# EAGLE design alpha-issue2-v23 (EAGLE 9.0.1)
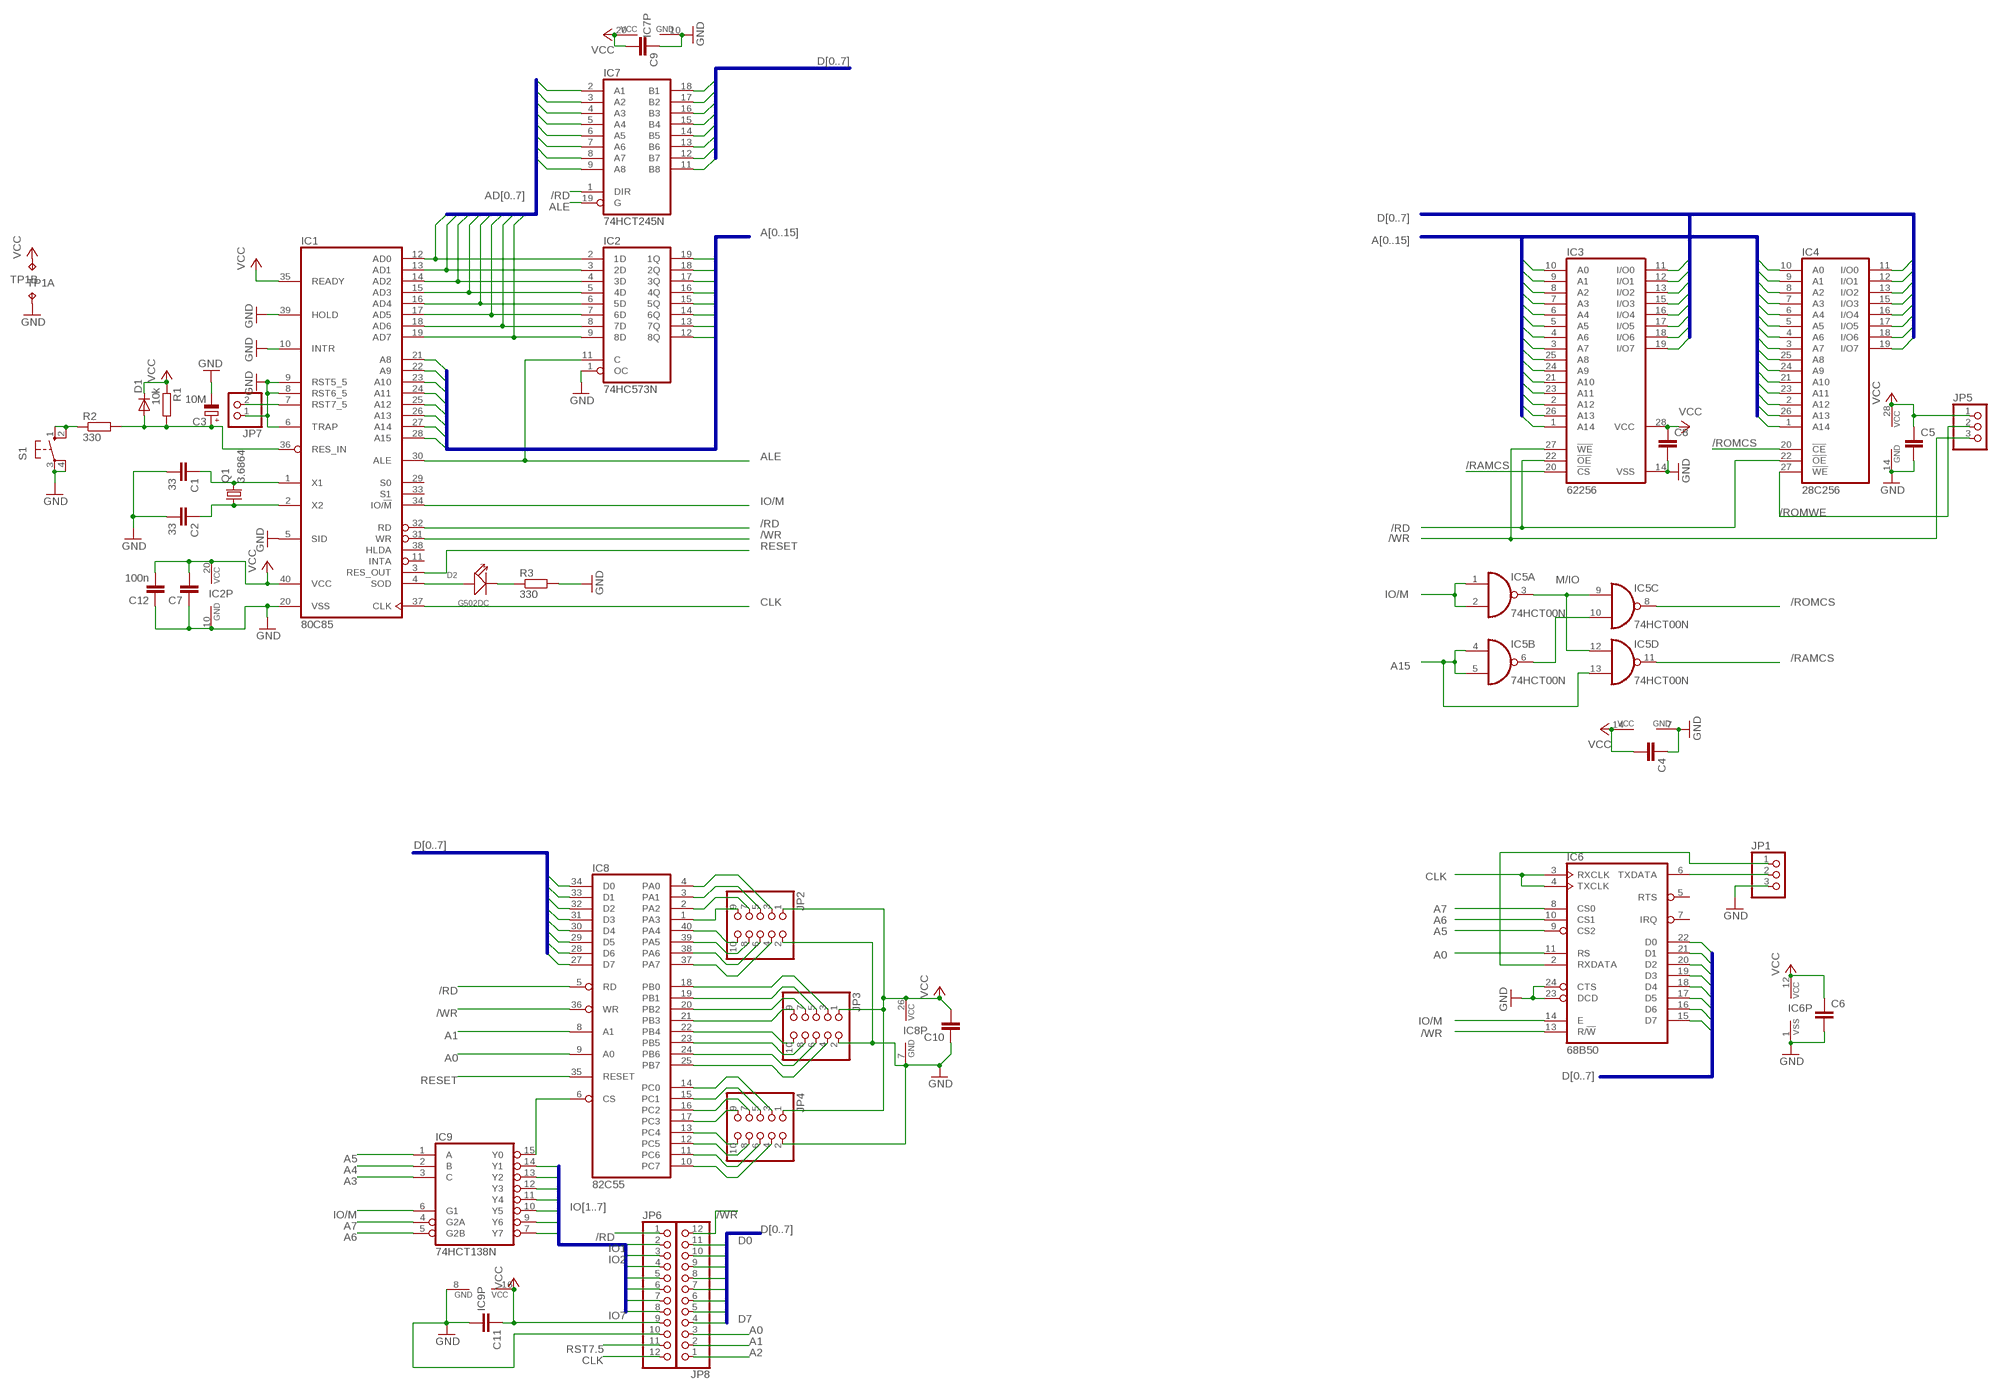
[diagram p0: schematic, sheet 1]

## Parts
C1  33  C-EU025-040X050  [C025-040X050]
C2  33  C-EU025-040X050  [C025-040X050]
C3  10M  CPOL-EUE5-8.5  [E5-8,5]
C4  C-EU050-025X075  [C050-025X075]
C5  C-EU050-025X075  [C050-025X075]
C6  C-EU050-025X075  [C050-025X075]
C7  C-EU050-025X075  [C050-025X075]
C8  C-EU050-025X075  [C050-025X075]
C9  C-EU050-025X075  [C050-025X075]
C10  C-EU050-025X075  [C050-025X075]
C11  C-EU050-025X075  [C050-025X075]
C12  100n  C-EU050-025X075  [C050-025X075]
D1  1N4004  [DO41-10]
D2  G502DC  DIP-LED-GREEN-GREEN(2P-D5MM)  [LED2-2.54-D5.0MM]
IC1  80C85  8085  [DIL40]
IC2  74HC573N  [DIL20]
IC3  62256  62256P  [DIL28-6]
IC4  28C256  [DIL28]
IC5  74HCT00N  [DIL14]
IC6  68B50  6850  [DIL24]
IC7  74HCT245N  [DIL20]
IC8  82C55  8255A  [DIL40]
IC9  74HCT138N  [DIL16]
JP1  PINHD-1X3  [1X03]
JP2  PINHD-2X5  [2X05]
JP3  PINHD-2X5  [2X05]
JP4  PINHD-2X5  [2X05]
JP5  PINHD-1X3  [1X03]
JP6  PINHD-1X12  [1X12]
JP7  PINHD-1X2  [1X02]
JP8  PINHD-1X12  [1X12]
Q1  3.6864  CRYSTALHC49S  [HC49/S]
R1  10k  R-EU_0207/10  [0207/10]
R2  330  R-EU_0207/10  [0207/10]
R3  330  R-EU_0207/7  [0207/7]
S1  40-XX  [B3F-40XX]
TP1  TP2P2-38-17  [P2-38-17]

## Nets
/RAMCS: IC3.20(!CS) IC5.11(D:O)
/RD: IC1.32(RD) IC3.22(!OE) IC4.22(!OE) IC7.1(DIR) IC8.5(RD) JP6.1
/ROMCS: IC4.20(!CE) IC5.8(C:O)
/ROMWE [gnd]: IC4.27(!WE) JP5.2
/WR: IC1.31(WR) IC3.27(!WE) IC6.13(R/!W) IC8.36(WR) JP5.3 JP8.12
A0: IC2.19(1Q) IC3.10(A0) IC4.10(A0) IC6.11(RS) IC8.9(A0) JP8.3
A1: IC2.18(2Q) IC3.9(A1) IC4.9(A1) IC8.8(A1) JP8.2
A2: IC2.17(3Q) IC3.8(A2) IC4.8(A2) JP8.1
A3: IC2.16(4Q) IC3.7(A3) IC4.7(A3) IC9.3(C)
A4: IC2.15(5Q) IC3.6(A4) IC4.6(A4) IC9.2(B)
A5: IC2.14(6Q) IC3.5(A5) IC4.5(A5) IC6.9(CS2) IC9.1(A)
A6: IC2.13(7Q) IC3.4(A6) IC4.4(A6) IC6.10(CS1) IC9.5(G2B)
A7: IC2.12(8Q) IC3.3(A7) IC4.3(A7) IC6.8(CS0) IC9.4(G2A)
A8: IC1.21(A8) IC3.25(A8) IC4.25(A8)
A9: IC1.22(A9) IC3.24(A9) IC4.24(A9)
A10: IC1.23(A10) IC3.21(A10) IC4.21(A10)
A11: IC1.24(A11) IC3.23(A11) IC4.23(A11)
A12: IC1.25(A12) IC3.2(A12) IC4.2(A12)
A13: IC1.26(A13) IC3.26(A13) IC4.26(A13)
A14: IC1.27(A14) IC3.1(A14) IC4.1(A14)
A15: IC1.28(A15) IC5.4(B:I0) IC5.5(B:I1) IC5.13(D:I1)
ALE: IC1.30(ALE) IC2.11(C) IC7.19(G)
CLK: IC1.37(CLK) IC6.3(RXCLK) IC6.4(TXCLK) JP6.12
D0: IC3.11(I/O0) IC4.11(I/O0) IC6.22(D0) IC7.18(B1) IC8.34(D0) JP8.11
D1: IC3.12(I/O1) IC4.12(I/O1) IC6.21(D1) IC7.17(B2) IC8.33(D1) JP8.10
D2: IC3.13(I/O2) IC4.13(I/O2) IC6.20(D2) IC7.16(B3) IC8.32(D2) JP8.9
D3: IC3.15(I/O3) IC4.15(I/O3) IC6.19(D3) IC7.15(B4) IC8.31(D3) JP8.8
D4: IC3.16(I/O4) IC4.16(I/O4) IC6.18(D4) IC7.14(B5) IC8.30(D4) JP8.7
D5: IC3.17(I/O5) IC4.17(I/O5) IC6.17(D5) IC7.13(B6) IC8.29(D5) JP8.6
D6: IC3.18(I/O6) IC4.18(I/O6) IC6.16(D6) IC7.12(B7) IC8.28(D6) JP8.5
D7: IC3.19(I/O7) IC4.19(I/O7) IC6.15(D7) IC7.11(B8) IC8.27(D7) JP8.4
DX0: IC1.12(AD0) IC2.2(1D) IC7.2(A1)
DX1: IC1.13(AD1) IC2.3(2D) IC7.3(A2)
DX2: IC1.14(AD2) IC2.4(3D) IC7.4(A3)
DX3: IC1.15(AD3) IC2.5(4D) IC7.5(A4)
DX4: IC1.16(AD4) IC2.6(5D) IC7.6(A5)
DX5: IC1.17(AD5) IC2.7(6D) IC7.7(A6)
DX6: IC1.18(AD6) IC2.8(7D) IC7.8(A7)
DX7: IC1.19(AD7) IC2.9(8D) IC7.9(A8)
GND [gnd]: C1.2 C2.2 C3.- C4.1 C5.2 C6.2 C7.1 C8.2 C9.1 C10.1 C11.2 C12.1 IC1.5(SID) IC1.6(TRAP) IC1.8(RST6_5) IC1.9(RST5_5) IC1.10(INTR) IC1.20(VSS) IC1.39(HOLD) IC2.1(OC) IC2.10(GND) IC3.14(VSS) IC4.14(GND) IC5.7(P:GND) IC6.1(VSS) IC6.23(DCD) IC6.24(CTS) IC7.10(GND) IC8.7(GND) IC9.8(GND) JP1.3 JP2.2 JP3.2 JP4.2 JP6.10 JP7.1 R3.2 S1.3(P) S1.4(P1) TP1.TP-1
IO1: IC9.14(Y1) JP6.2
IO2: IC9.13(Y2) JP6.3
IO3: IC9.12(Y3) JP6.4
IO4: IC9.11(Y4) JP6.5
IO5: IC9.10(Y5) JP6.6
IO6: IC9.9(Y6) JP6.7
IO7: IC9.7(Y7) JP6.8
IO/M: IC1.34(IO/!M) IC5.1(A:I0) IC5.2(A:I1) IC6.14(E) IC9.6(G1)
M/IO: IC5.3(A:O) IC5.9(C:I0) IC5.12(D:I0)
N$1: C1.1 IC1.1(X1) Q1.2
N$2: C2.1 IC1.2(X2) Q1.1
N$3: D2.+ IC1.4(SOD)
N$4: D2.- R3.1
N$5: IC6.6(TXDATA) JP1.2
N$6: C3.+ D1.A IC1.36(RES_IN) R1.2 R2.2
N$7: R2.1 S1.1(S) S1.2(S1)
N$8: IC5.6(B:O) IC5.10(C:I1)
N$9: IC8.1(PA3) JP2.9
N$10: IC6.2(RXDATA) JP1.1
N$11: IC8.2(PA2) JP2.7
N$12: IC8.3(PA1) JP2.5
N$13: IC8.4(PA0) JP2.3
N$14: IC8.40(PA4) JP2.10
N$15: IC8.39(PA5) JP2.8
N$16: IC8.38(PA6) JP2.6
N$17: IC8.37(PA7) JP2.4
N$18: IC8.21(PB3) JP3.9
N$19: IC8.20(PB2) JP3.7
N$20: IC8.19(PB1) JP3.5
N$21: IC8.18(PB0) JP3.3
N$22: IC8.22(PB4) JP3.10
N$23: IC8.23(PB5) JP3.8
N$24: IC8.24(PB6) JP3.6
N$25: IC8.25(PB7) JP3.4
N$26: IC8.17(PC3) JP4.9
N$27: IC8.13(PC4) JP4.10
N$28: IC8.16(PC2) JP4.7
N$29: IC8.15(PC1) JP4.5
N$30: IC8.14(PC0) JP4.3
N$31: IC8.12(PC5) JP4.8
N$32: IC8.11(PC6) JP4.6
N$33: IC8.10(PC7) JP4.4
N$36: IC8.6(CS) IC9.15(Y0)
RESET: IC1.3(RES_OUT) IC8.35(RESET)
RST7.5: IC1.7(RST7_5) JP6.11 JP7.2
VCC [gnd]: C4.2 C5.1 C6.1 C7.2 C8.1 C9.2 C10.2 C11.1 C12.2 D1.C IC1.35(READY) IC1.40(VCC) IC2.20(VCC) IC3.28(VCC) IC4.28(VCC) IC5.14(P:VCC) IC6.12(VCC) IC7.20(VCC) IC8.26(VCC) IC9.16(VCC) JP2.1 JP3.1 JP4.1 JP5.1 JP6.9 R1.1 TP1.TP-2
Unconnected: IC1.11(INTA) IC1.29(S0) IC1.33(S1) IC1.38(HLDA) IC6.5(RTS) IC6.7(IRQ)

## Buses
A[0..15]
D[0..7]
AD[0..7]
IO[1..7]

## Library data of the parts
C1 C2 C4-C12 = rcl:C-EU: CAPACITOR, European symbol
C3 = rcl:CPOL-EU: POLARIZED CAPACITOR, European symbol
D1 = diode:1N4004: DIODE general purpose rectifier, 1 A
D2 = Seeed-LED:DIP-LED-GREEN-GREEN(2P-D5MM): 304090038; MPN: G502DC
IC1 = micro-intel:8085: MICROCOMPUTER/PERIPHERAL DEVICE; OC_FARNELL: unknown; OC_NEWARK: unknown
IC2 = 74xx-eu:74*573: 8-bit D latch BUS DRIVER
IC3 = memory-hitachi:62256P: MEMORY; OC_FARNELL: unknown; OC_NEWARK: unknown
IC4 = memory:28C256: MEMORY
IC5 = 74xx-eu:74*00: Quad 2-input NAND gate
IC6 = micro-motorola:6850: MICROCONTROLLER/MEMORY DEVICE; MF: NTE ELECTRONICS; MPN: NTE6850; OC_FARNELL: 4899775; OC_NEWARK: 31C2457
IC7 = 74xx-eu:74*245: Octal BUS TRANSCEIVER, 3-state
IC8 = micro-intel:8255A: MICROCOMPUTER/PERIPHERAL DEVICE; OC_FARNELL: unknown; OC_NEWARK: unknown
IC9 = 74xx-eu:74*138: 3-line to 8-line DECODER/DEMULTIPLEXER
JP1 JP5 = pinhead:PINHD-1X3: PIN HEADER
JP2-JP4 = pinhead:PINHD-2X5: PIN HEADER
JP6 JP8 = pinhead:PINHD-1X12: PIN HEADER
JP7 = pinhead:PINHD-1X2: PIN HEADER
Q1 = crystal:CRYSTAL: CRYSTAL; OC_FARNELL: 1667008; OC_NEWARK: unknown
R1-R3 = rcl:R-EU_: RESISTOR, European symbol
S1 = adafruit:40-XX: OMRON SWITCH; MF: OMRON COMPONENTS USA; MPN: B3F-4000; OC_FARNELL: 176434; OC_NEWARK: 36K3105
TP1 = testpad:TP2: Test pad

## Net classes
0 default: width 0.305 mm
1 gnd: width 0.61 mm

## Board
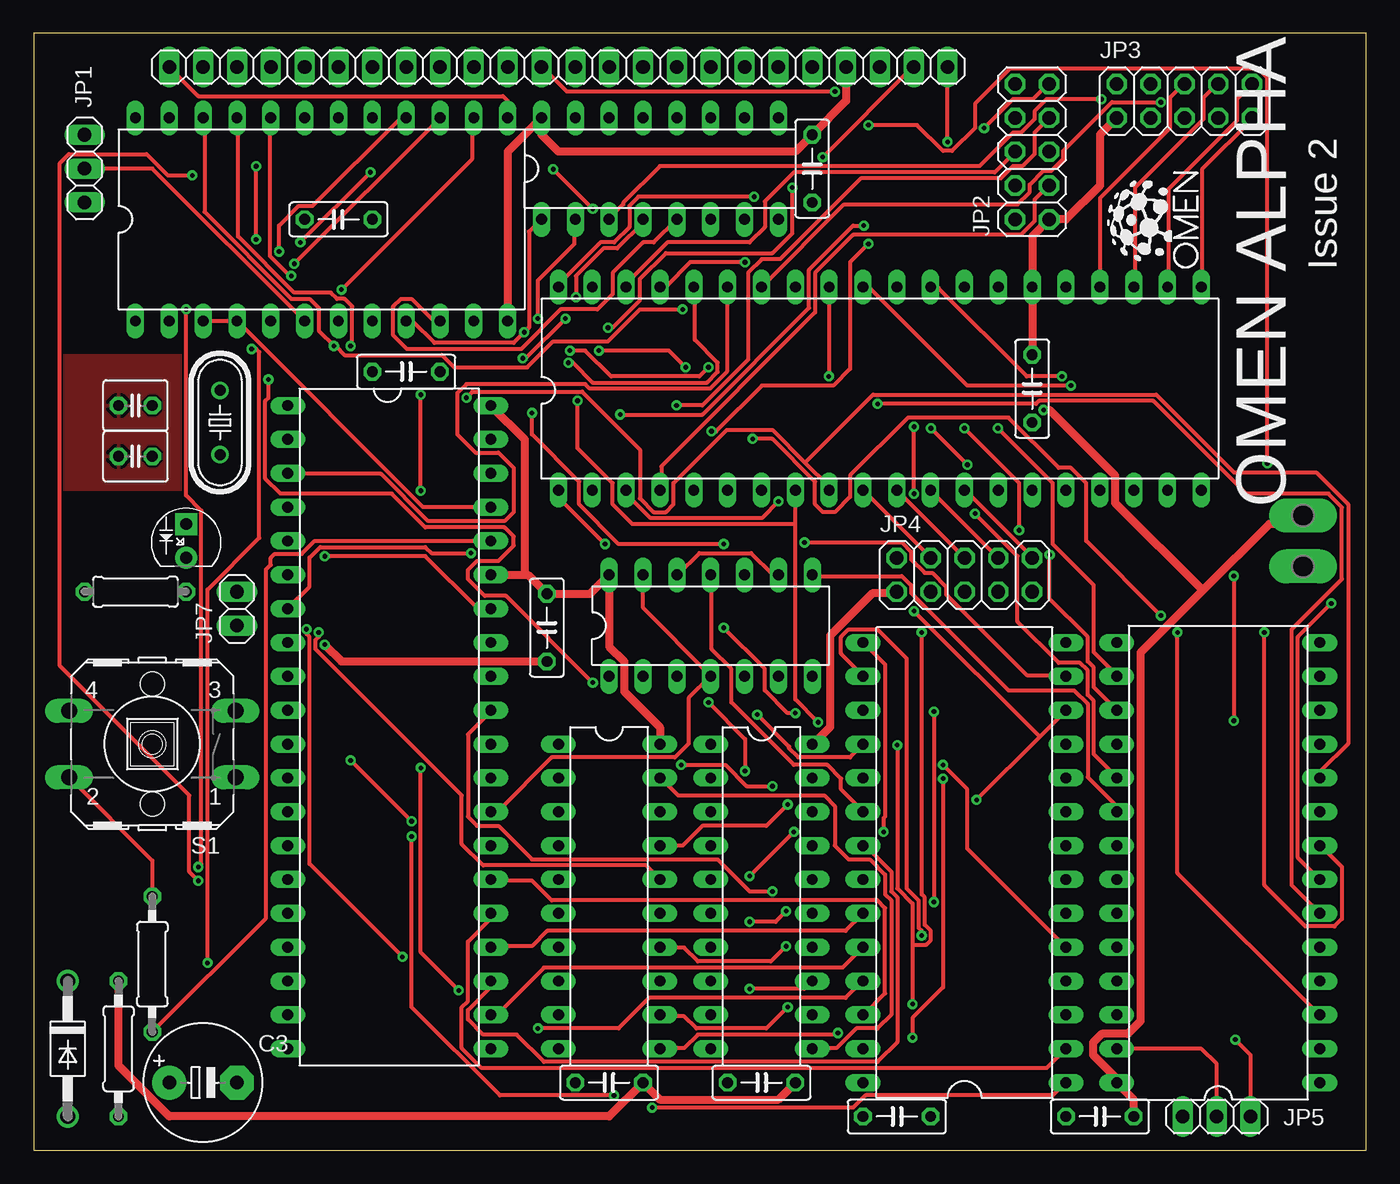
[diagram p1: board, top side]
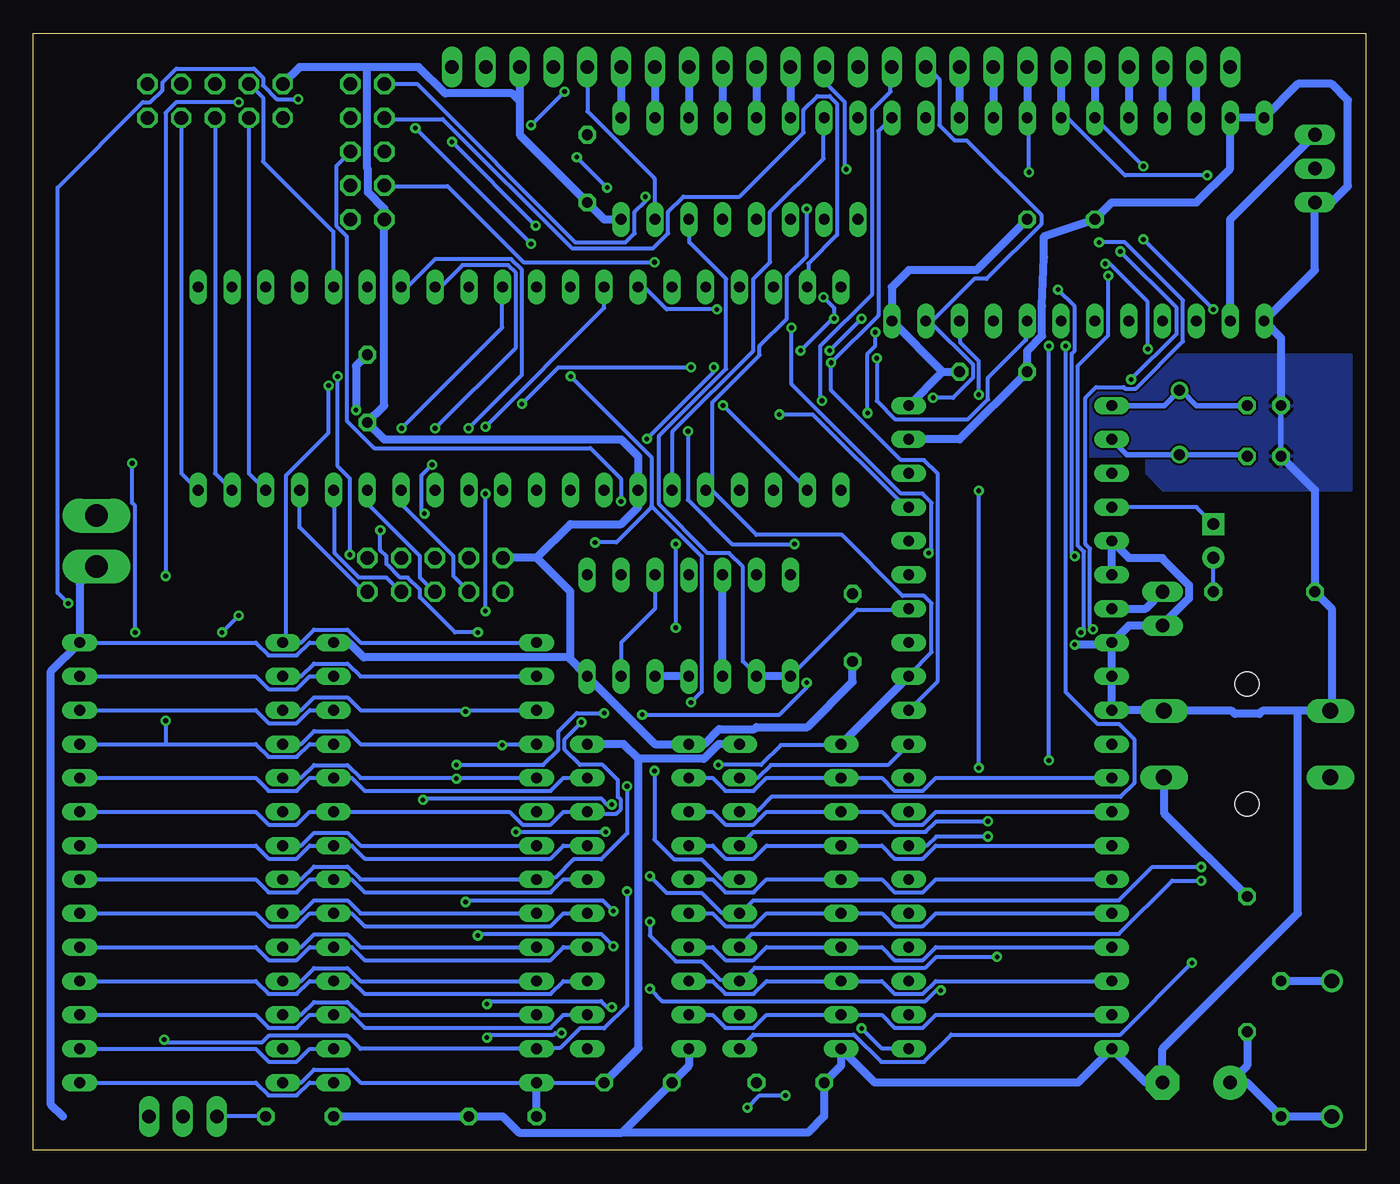
[diagram p2: board, bottom side, seen from below]

Size 100 x 83.81 mm. Coordinates in mm from the lower left corner, seen from the top.
Outline: 0,0 100,0 100,83.81 0,83.81 0,0
Copper layers (1*16): Top 0.035mm / dielectric 1.5mm / Bottom 0.035mm
Design rules "default": minimum track width 6mil, minimum drill 0.35mm, track to track 6mil, track to pad 6mil, pad to pad 6mil, via to via 6mil, smd to smd 6mil, copper to edge 40mil, drill to drill 6mil, minimum pad ring 10mil, minimum via ring 8mil, stop-mask expansion 4mil, vias tented up to drill 0mil, thermal gap 10mil

### Footprints (pad centres in the part's own frame; a part is rotated, then mirrored left to right if it is on the bottom)
C025-040X050 = drill 0.813 octagon: 1 -1.27,0; 2 1.27,0
E5-8,5 = drill 1.016 pad 2.54: + -2.54,0 | drill 1.016 pad 2.54 octagon: - 2.54,0
C050-025X075 = drill 0.813 octagon: 1 -2.54,0; 2 2.54,0
DO41-10 = drill 1.118: A 5.08,0; C -5.08,0
LED2-2.54-D5.0MM = drill 0.889 pad 1.651 square: + -1.27,0 | drill 0.889 pad 1.651: - 1.27,0
DIL40 = drill 0.813 long: 1 -24.13,-7.62; 2 -21.59,-7.62; 3 -19.05,-7.62; 4 -16.51,-7.62; 5 -13.97,-7.62; 6 -11.43,-7.62; 7 -8.89,-7.62; 8 -6.35,-7.62; 9 -3.81,-7.62; 10 -1.27,-7.62; 11 1.27,-7.62; 12 3.81,-7.62; 13 6.35,-7.62; 14 8.89,-7.62; 15 11.43,-7.62; 16 13.97,-7.62; 17 16.51,-7.62; 18 19.05,-7.62; 19 21.59,-7.62; 20 24.13,-7.62; 21 24.13,7.62; 22 21.59,7.62; 23 19.05,7.62; 24 16.51,7.62; 25 13.97,7.62; 26 11.43,7.62; 27 8.89,7.62; 28 6.35,7.62; 29 3.81,7.62; 30 1.27,7.62; 31 -1.27,7.62; 32 -3.81,7.62; 33 -6.35,7.62; 34 -8.89,7.62; 35 -11.43,7.62; 36 -13.97,7.62; 37 -16.51,7.62; 38 -19.05,7.62; 39 -21.59,7.62; 40 -24.13,7.62
DIL20 = drill 0.813 long: 1 -11.43,-3.81; 2 -8.89,-3.81; 3 -6.35,-3.81; 4 -3.81,-3.81; 5 -1.27,-3.81; 6 1.27,-3.81; 7 3.81,-3.81; 8 6.35,-3.81; 9 8.89,-3.81; 10 11.43,-3.81; 11 11.43,3.81; 12 8.89,3.81; 13 6.35,3.81; 14 3.81,3.81; 15 1.27,3.81; 16 -1.27,3.81; 17 -3.81,3.81; 18 -6.35,3.81; 19 -8.89,3.81; 20 -11.43,3.81
DIL28-6 = drill 0.813 long: 1 -16.51,-7.62; 2 -13.97,-7.62; 3 -11.43,-7.62; 4 -8.89,-7.62; 5 -6.35,-7.62; 6 -3.81,-7.62; 7 -1.27,-7.62; 8 1.27,-7.62; 9 3.81,-7.62; 10 6.35,-7.62; 11 8.89,-7.62; 12 11.43,-7.62; 13 13.97,-7.62; 14 16.51,-7.62; 15 16.51,7.62; 16 13.97,7.62; 17 11.43,7.62; 18 8.89,7.62; 19 6.35,7.62; 20 3.81,7.62; 21 1.27,7.62; 22 -1.27,7.62; 23 -3.81,7.62; 24 -6.35,7.62; 25 -8.89,7.62; 26 -11.43,7.62; 27 -13.97,7.62; 28 -16.51,7.62
DIL28 = drill 0.813 long: 1 -16.51,-7.62; 2 -13.97,-7.62; 3 -11.43,-7.62; 4 -8.89,-7.62; 5 -6.35,-7.62; 6 -3.81,-7.62; 7 -1.27,-7.62; 8 1.27,-7.62; 9 3.81,-7.62; 10 6.35,-7.62; 11 8.89,-7.62; 12 11.43,-7.62; 13 13.97,-7.62; 14 16.51,-7.62; 15 16.51,7.62; 16 13.97,7.62; 17 11.43,7.62; 18 8.89,7.62; 19 6.35,7.62; 20 3.81,7.62; 21 1.27,7.62; 22 -1.27,7.62; 23 -3.81,7.62; 24 -6.35,7.62; 25 -8.89,7.62; 26 -11.43,7.62; 27 -13.97,7.62; 28 -16.51,7.62
DIL14 = drill 0.813 long: 1 -7.62,-3.81; 2 -5.08,-3.81; 3 -2.54,-3.81; 4 0,-3.81; 5 2.54,-3.81; 6 5.08,-3.81; 7 7.62,-3.81; 8 7.62,3.81; 9 5.08,3.81; 10 2.54,3.81; 11 0,3.81; 12 -2.54,3.81; 13 -5.08,3.81; 14 -7.62,3.81
DIL24 = drill 0.813 long: 1 -13.97,-7.62; 2 -11.43,-7.62; 3 -8.89,-7.62; 4 -6.35,-7.62; 5 -3.81,-7.62; 6 -1.27,-7.62; 7 1.27,-7.62; 8 3.81,-7.62; 9 6.35,-7.62; 10 8.89,-7.62; 11 11.43,-7.62; 12 13.97,-7.62; 13 13.97,7.62; 14 11.43,7.62; 15 8.89,7.62; 16 6.35,7.62; 17 3.81,7.62; 18 1.27,7.62; 19 -1.27,7.62; 20 -3.81,7.62; 21 -6.35,7.62; 22 -8.89,7.62; 23 -11.43,7.62; 24 -13.97,7.62
DIL16 = drill 0.813 long: 1 -8.89,-3.81; 2 -6.35,-3.81; 3 -3.81,-3.81; 4 -1.27,-3.81; 5 1.27,-3.81; 6 3.81,-3.81; 7 6.35,-3.81; 8 8.89,-3.81; 9 8.89,3.81; 10 6.35,3.81; 11 3.81,3.81; 12 1.27,3.81; 13 -1.27,3.81; 14 -3.81,3.81; 15 -6.35,3.81; 16 -8.89,3.81
1X03 = drill 1.016 long: 1 -2.54,0; 2 0,0; 3 2.54,0
2X05 = drill 1.016 octagon: 1 -5.08,-1.27; 2 -5.08,1.27; 3 -2.54,-1.27; 4 -2.54,1.27; 5 0,-1.27; 6 0,1.27; 7 2.54,-1.27; 8 2.54,1.27; 9 5.08,-1.27; 10 5.08,1.27
1X12 = drill 1.016 long: 1 -13.97,0; 2 -11.43,0; 3 -8.89,0; 4 -6.35,0; 5 -3.81,0; 6 -1.27,0; 7 1.27,0; 8 3.81,0; 9 6.35,0; 10 8.89,0; 11 11.43,0; 12 13.97,0
1X02 = drill 1.016 long: 1 -1.27,0; 2 1.27,0
HC49/S = drill 0.813: 1 -2.413,0; 2 2.413,0
0207/10 = drill 0.813 octagon: 1 -5.08,0; 2 5.08,0
0207/7 = drill 0.813 octagon: 1 -3.81,0; 2 3.81,0
B3F-40XX = drill 1.194 long: 1 -6.248,2.489; 2 6.248,2.489; 3 -6.248,-2.489; 4 6.248,-2.489 | hole 1.803: 0,-4.496; 0,4.496
P2-38-17 = drill 1.702 pad 2.121 long: TP-1 -1.905,0; TP-2 1.905,0

### Placement (x,y rotation side)
C1  7.62,55.88 180 top
C2  7.62,52.07 180 top
C3  12.7,5.08 0 top
C4  38.51,39.22 90 top
C5  43.18,5.08 180 top
C6  64.77,2.54 0 top
C7  80.01,2.54 0 top
C8  22.86,69.85 180 top
C9  54.61,5.08 0 top
C10  74.93,57.15 90 top
C11  58.42,73.66 270 top
C12  27.94,58.42 0 top
D1  2.54,7.62 270 top
D2  11.43,45.72 270 top
IC1  26.67,31.75 270 top
IC2  54.61,19.05 270 top
IC3  69.85,21.59 90 top
IC4  88.9,21.59 90 top
IC5  50.8,39.37 0 top
IC6  21.59,69.85 0 top
IC7  43.18,19.05 270 top
IC8  63.5,57.15 0 top
IC9  46.99,73.66 0 top
JP1  3.81,73.66 270 top
JP2  74.93,74.93 90 top
JP3  86.36,78.74 0 top
JP4  69.85,43.18 0 top
JP5  88.77,2.54 0 top
JP6  54.61,81.28 0 top
JP7  15.24,40.64 90 top
JP8  24.13,81.28 180 top
Q1  13.97,54.61 90 top
R1  6.35,7.62 270 top
R2  8.89,13.97 270 top
R3  7.62,41.91 180 top
S1  8.89,30.48 180 top
TP1  95.25,45.72 90 top

### Tracks (layer width: path | path; a pad name or v marks a point on that pad's centre or on a via)
/RAMCS
  Top 0.305: IC5.11 50.86,43.09 50.86,37.6 52.35,36.12 52.35,33.6 57.04,28.92 59.55,28.92 60.58,27.89 60.58,27.09 62.18,25.49 IC3.20
/RD  (via drill 0.35)
  Top 0.305: v41.95,70.64 v38.98,73.61 | v55.44,27.32 53.49,27.32 51.89,28.92 v48.58,28.92
  Bottom 0.305: IC4.22 79.9,20.32 78.94,21.29 76.41,21.29 75.44,20.32 IC3.22 62.18,20.46 60.81,20.46 59.44,21.83 57.38,21.83 55.44,23.77 v55.44,27.32 | IC1.32 34.18,35.78 32.58,37.38 32.58,41.03 33.15,41.6 34.75,41.6 39.32,46.18 45.72,46.18 49.03,49.49 49.49,49.49 IC8.5 49.03,49.61 49.03,56.12 45.49,59.66 45.49,60.35 43.43,62.41 43.43,65.61 41.95,67.09 v41.95,70.64 | v38.98,73.61 39.09,73.72 39.09,78.64 40.58,80.12 40.58,81.27 JP6.1 | v48.58,28.92 45.38,28.92 43.89,30.4 39.66,30.4 IC7.1
  Bottom 0.61: IC1.32 IC7.1
/ROMCS
  Top 0.305: IC4.20 81.27,25.49 81.27,25.83 79.1,28 79.1,33.49 78.07,34.52 73.15,34.52 65.84,41.83 65.84,42.41 65.15,43.09 58.52,43.09 IC5.8
/ROMWE
  Top 0.305: JP5.2 88.77,6.48 87.63,7.62 IC4.27
/WR  (via drill 0.35)
  Top 0.305: JP8.12 12.34,79.1 35.2,79.1 35.56,78.74 IC6.13 | v40.12,59.09 40.46,59.09 41.95,57.61 50.52,57.61 51.32,58.41 51.32,59.09 49.61,60.81 49.61,64.69 IC8.36 | v55.44,19.43 53.72,19.43 51.32,21.83 37.38,21.83 34.86,24.35 33.26,24.35 32.58,25.03 32.58,31.2 34.29,32.92 IC1.31 | v90.17,8.3 91.31,7.16 JP5.3
  Bottom 0.305: IC6.13 35.66,77.38 36.58,76.47 36.58,62.64 v40.12,59.09 40.12,57.04 34.86,51.78 33.15,51.78 32.12,50.75 32.12,35.2 34.29,33.03 IC1.31 | v55.44,19.43 55.44,10.86 57.15,9.14 58.98,9.14 60.47,7.66 62.18,7.66 IC3.27 75.44,7.62 76.41,8.59 82.34,8.59 82.85,8.08 90.17,8.08 v90.17,8.3
A0  (via drill 0.35)
  Top 0.305: 57.89,51.61 55.44,54.06 52.01,54.06 48.01,50.06 48.01,48.46 47.43,47.89 46.52,47.89 45.49,48.92 45.49,52.58 41.15,56.92 32.92,56.92 v32.46,56.46 | 57.89,51.61 59.66,49.84 59.66,49.61 IC8.9 | 57.89,51.61 62.98,56.69 84.24,56.69 90.07,50.86 96.24,50.86 98.64,48.46 98.64,30.52 96.58,28.46 96.58,28 IC4.10
  Bottom 0.305: IC4.10 83.31,27.94 82.34,26.98 80.22,26.98 79.25,27.94 IC3.10 76.09,27.94 75.13,26.98 61.17,26.98 60.2,27.94 IC2.19 | JP8.3 32.92,81.27 32,80.35 32,76.92 30.86,75.78 29.95,75.78 24.35,70.18 24.35,69.49 28.46,65.38 29.38,65.38 32.46,62.29 32.92,62.29 IC6.11 32.69,62.18 29.49,58.98 29.49,57.95 30.98,56.46 v32.46,56.46
A1  (via drill 0.35)
  Top 0.305: 57.15,46.98 57.15,33.83 v58.86,32.12 | 57.15,46.98 IC8.8 | v40.8,56.24 40.8,52.69 43.43,50.06 43.43,48.46 44.92,46.98 57.15,46.98
  Bottom 0.305: IC4.9 83.31,25.4 82.34,24.43 80.22,24.43 79.25,25.4 IC3.9 64.25,25.4 63.29,24.43 61.17,24.43 60.2,25.4 IC2.18 58.41,25.26 56.24,25.26 55.89,25.6 55.89,26.29 56.12,26.52 56.12,27.77 57.26,28.92 58.98,28.92 60.12,30.06 60.12,30.86 v58.86,32.12 | v40.8,56.24 40.92,56.35 40.92,60.35 37.03,64.24 37.03,78.07 35.66,79.44 35.66,81.27 JP8.2
A2  (via drill 0.35)
  Top 0.305: v60.12,79.44 40.01,79.44 38.18,81.27 JP8.1 | v62.64,76.92 66.29,76.92 68.24,74.98 68.92,74.98 70.64,76.69 70.64,78.52 73.27,81.15 91.9,81.15 92.58,80.47 v92.58,51.55 | v92.35,38.86 92.35,19.89 95.44,16.8 97.61,16.8 98.18,17.37 98.18,21.26 96.58,22.86 IC4.8
  Bottom 0.305: IC4.8 83.31,22.86 82.34,21.89 80.22,21.89 79.25,22.86 IC3.8 76.09,22.86 75.13,21.89 61.17,21.89 60.2,22.86 IC2.17 | v62.64,76.92 v60.12,79.44 | v92.58,51.55 92.58,48.58 92.35,48.35 v92.35,38.86
A3  (via drill 0.35)
  Top 0.305: v80.12,78.87 76.01,78.87 75.09,77.95 75.09,77.38 74.07,76.35 73.5,76.35 70.98,73.84 46.98,73.84 44.23,71.09 44.23,70.98 43.2,69.95 IC9.3 | v97.38,41.03 94.87,38.52 94.87,21.95 96.47,20.34 IC4.7
  Bottom 0.305: IC4.7 83.31,20.32 82.34,19.36 80.22,19.36 79.25,20.32 IC3.7 76.09,20.32 75.13,19.36 61.17,19.36 60.2,20.32 IC2.16 | v80.12,78.87 81.72,78.87 82.75,79.9 82.75,80.47 83.44,81.15 89.27,81.15 90.3,80.12 90.3,79.55 91.21,78.64 91.78,78.64 98.18,72.24 98.18,41.83 v97.38,41.03
A4  (via drill 0.35)
  Top 0.305: v37.83,62.41 37.83,65.27 40.58,68.01 40.58,69.84 IC9.2 | v40.23,60.01 41.38,60.01 43.32,58.06 49.95,58.06 v50.63,58.75 | v63.32,56.01 75.21,56.01 75.44,56.24 84.01,56.24 90.98,49.26 97.16,49.26 98.18,48.23 98.18,42.86 94.41,39.09 94.41,19.89 IC4.6
  Bottom 0.305: IC4.6 83.31,17.78 82.34,16.82 80.22,16.82 79.25,17.78 IC3.6 76.09,17.78 75.13,16.82 61.17,16.82 60.2,17.78 IC2.15 | v40.23,60.01 v37.83,62.41 | v50.63,58.75 60.58,58.75 v63.32,56.01
A5  (via drill 0.35)
  Top 0.305: IC6.9 28,62.18 28.46,62.18 30.06,60.58 36.01,60.58 v36.8,61.38 37.15,61.72 37.15,68.92 38.06,69.84 IC9.1 | v37.38,55.32 37.38,53.72 40.92,50.18 40.92,48.46 43.89,45.49 v51.78,45.49 | v51.78,39.2 54.86,36.12 54.86,34.52 56.58,32.8 v57.15,32.8 | v68.24,28.92 70.07,27.09 70.07,22.63 77.38,15.32 IC3.5
  Bottom 0.305: IC4.5 83.31,15.24 82.34,14.28 80.22,14.28 79.25,15.24 IC3.5 76.09,15.24 75.13,14.28 61.17,14.28 60.2,15.24 IC2.14 | v36.8,61.38 36.8,60.35 37.38,59.78 v37.38,55.32 | v51.78,39.2 v51.78,45.49 | v57.15,32.8 59.21,32.8 60.58,31.43 60.58,30.06 61.72,28.92 v68.24,28.92
A6  (via drill 0.35)
  Top 0.305: IC6.10 30.4,62.29 29.95,62.29 28.35,63.89 27.55,63.89 26.98,63.32 26.98,61.15 28,60.12 36.58,60.12 39.55,63.09 42.29,63.09 43.43,64.24 43.43,65.84 45.72,68.12 46.52,68.12 48.23,69.84 IC9.5 | v29.03,49.49 v29.03,56.69 | v29.03,28.69 29.03,14.86 v31.89,12 | v53.72,12.12 57.84,12.12 IC2.13
  Bottom 0.305: IC4.4 83.31,12.7 82.34,11.73 80.22,11.73 79.25,12.7 IC3.4 76.09,12.7 75.13,11.73 61.17,11.73 60.2,12.7 IC2.13 | v29.03,56.69 29.03,59.21 30.4,60.58 30.4,62.18 IC6.10 | v29.03,28.69 v29.03,49.49 | v31.89,12 32.23,12 33.03,11.2 52.81,11.2 v53.72,12.12
A7  (via drill 0.35)
  Top 0.305: v36.69,59.44 36.92,59.44 v39.89,62.41 | v40.69,64.01 40.69,65.61 42.75,67.67 43.78,67.67 45.72,69.61 IC9.4 | v42.41,60.01 47.66,60.01 v48.92,58.75 | v53.95,53.38 55.44,53.38 58.64,50.18 58.64,48.46 59.21,47.89 60.12,47.89 61.27,49.03 61.27,50.63 65.61,54.98 73.15,54.98 76.92,51.21 77.84,51.21 78.98,50.06 78.98,45.72 v84.58,40.12 | v85.84,38.86 85.84,20.8 96.47,10.17 IC4.3
  Bottom 0.305: IC4.3 83.31,10.16 82.34,9.2 80.22,9.2 79.25,10.16 IC3.3 76.09,10.16 75.13,9.2 61.17,9.2 60.2,10.16 IC2.12 | v36.69,59.44 36.69,56.24 35.32,54.86 29.83,54.86 28.35,56.35 28.35,57.95 25.49,60.81 25.49,62.18 IC6.8 | v40.69,64.01 39.89,63.21 v39.89,62.41 40.01,62.41 v42.41,60.01 | v48.92,58.75 48.92,58.41 v53.95,53.38 | v85.84,38.86 v84.58,40.12
A8  (via drill 0.35)
  Top 0.305: v37.83,9.14 43.89,9.14 46.18,11.43 60.92,11.43 62.18,12.69 IC3.25
  Bottom 0.305: IC4.25 79.9,12.7 78.94,13.66 76.41,13.66 75.44,12.7 IC3.25 | v37.83,9.14 36.35,7.66 34.29,7.66 IC1.21
A9
  Top 0.305: IC1.22 34.29,10.17 34.75,10.17 38.29,13.72 60.69,13.72 62.18,15.2 IC3.24
  Bottom 0.305: IC4.24 79.9,15.24 78.94,16.2 76.41,16.2 75.44,15.24 IC3.24
A10
  Top 0.305: IC1.23 34.29,12.23 32.58,10.52 32.58,9.83 33.72,8.69 36.23,8.69 38.29,6.63 63.32,6.63 64.81,8.12 64.81,18.97 64.35,19.43 64.35,20.92 62.41,22.86 IC3.21
  Bottom 0.305: IC4.21 79.9,22.86 78.94,23.82 76.41,23.82 75.44,22.86 IC3.21
A11
  Top 0.305: IC1.24 34.29,15.32 37.38,15.32 38.52,16.46 60.92,16.46 62.18,17.72 IC3.23
  Bottom 0.305: IC4.23 79.9,17.78 78.94,18.75 76.41,18.75 75.44,17.78 IC3.23
A12
  Top 0.305: IC1.25 34.29,17.37 32.58,15.66 32.58,11.2 32.12,10.74 32.12,7.66 33.6,6.17 76.01,6.17 77.38,7.54 IC3.2
  Bottom 0.305: IC4.2 83.31,7.62 82.34,6.66 80.22,6.66 79.25,7.62 IC3.2
A13
  Top 0.305: IC1.26 34.29,20.23 37.38,20.23 38.86,18.75 63.32,18.75 63.89,18.17 63.89,11.77 62.29,10.17 IC3.26
  Bottom 0.305: IC4.26 79.9,10.16 78.94,11.12 76.41,11.12 75.44,10.16 IC3.26
A14  (via drill 0.35)
  Top 0.305: v28.35,23.55 28.35,10.74 34.98,4.12 v43.55,4.12 | v46.41,3.2 61.49,3.2 62.41,4.12 76.47,4.12 77.38,5.03 IC3.1
  Bottom 0.305: IC4.1 83.31,5.08 82.34,4.12 80.22,4.12 79.25,5.08 IC3.1 | IC1.27 32.92,22.86 32.23,23.55 v28.35,23.55 | v43.55,4.12 45.49,4.12 v46.41,3.2
A15
  Top 0.305: IC1.28 34.29,25.49 34.86,25.49 38.86,29.49 48.12,29.49 49.15,30.52 49.15,33.95 50.75,35.55 IC5.4 50.75,35.66 45.72,40.69 IC5.13
  Bottom 0.61: IC5.4 IC5.5
ALE
  Top 0.305: IC2.11 58.52,7.66 60.24,7.66 61.72,9.14 63.32,9.14 64.35,10.17 64.35,18.75 63.89,19.2 63.89,20.69 62.75,21.83 61.15,21.83 60.12,22.86 60.12,25.83 59.32,26.63 48.35,26.63 47.09,27.89 IC7.19
  Bottom 0.305: IC7.19 45.61,27.94 44.65,28.91 35.87,28.91 IC1.30
CLK  (via drill 0.35)
  Top 0.305: IC6.3 IC6.4 29.21,48.26 IC1.37 | v68.58,75.67 JP6.12 | v62.29,69.38 61.49,69.38 58.18,66.06 58.18,63.21 50.18,55.21 v44.01,55.21
  Bottom 0.305: v62.29,69.38 v68.58,75.67 | v44.01,55.21 41.49,55.21 34.63,48.35 34.29,48.35 IC1.37
D0  (via drill 0.35)
  Top 0.305: IC6.22 12.8,77.38 12.8,70.41 19.32,63.89 20.69,63.89 21.37,63.21 21.37,61.49 v22.52,60.35 22.63,60.35 23.32,59.66 30.63,59.66 31.55,58.75 37.03,58.75 38.98,60.69 43.09,60.69 45.49,63.09 v48.69,63.09 | v90.07,43.09 v90.07,32.23 | v84.58,78.64 80.92,78.64 77.27,74.98 77.27,74.41 76.35,73.5 75.78,73.5 74.75,72.47 74.75,71.89 73.84,70.98 60.81,70.98 54.63,64.81 IC8.34
  Bottom 0.305: IC4.11 90.07,30.48 | 90.07,30.48 83.31,30.48 82.34,29.52 80.22,29.52 79.25,30.48 IC3.11 | v22.52,60.35 22.52,34.4 20.12,32 18.52,32 17.37,30.86 17.37,27.55 18.4,26.52 44.58,26.52 45.61,25.49 46.98,25.49 IC7.18 | v48.69,63.09 52.46,63.09 54.06,64.69 54.52,64.69 IC8.34 | v90.07,32.23 90.07,30.48 | v90.07,43.09 90.07,77.84 89.27,78.64 v84.58,78.64
  Bottom 0.61: IC6.22 JP8.11
D1  (via drill 0.35)
  Top 0.305: IC7.17 48.69,22.86 50.18,24.35 54.98,24.35 v56.58,25.95 | 75.5,31.03 77.38,32.92 IC3.12 | 75.5,31.03 v70.75,26.29 | v66.06,49.26 v66.06,54.29 | 75.5,31.03 v66.06,40.46 | v23.77,60.35 23.89,60.47 23.89,63.32 23.32,63.89 22.75,63.89 22.29,64.35 19.55,64.35 15.32,68.58 15.32,77.38 IC6.21 | v28.35,24.69 v23.77,29.26
  Bottom 0.305: IC4.12 83.31,33.02 82.34,32.05 80.22,32.05 79.25,33.02 IC3.12 | v56.58,25.95 56.92,25.95 57.38,26.4 70.64,26.4 v70.75,26.29 | IC8.33 57.15,63.21 v66.06,54.29 | v66.06,40.46 v66.06,49.26 | v23.77,29.26 v23.77,60.35 | v28.35,24.69 32.23,24.69 33.03,23.89 45.95,23.89 46.98,22.86 IC7.17
  Bottom 0.61: JP8.10 IC6.21
D2  (via drill 0.35)
  Top 0.305: v53.38,28.46 53.38,30.86 v50.63,33.6 | v59.66,58.06 59.66,64.69 IC8.32 | v19.32,65.61 19.2,65.61 17.72,67.09 17.72,77.38 IC6.20 | v21.37,38.86 21.37,38.52 21.14,38.29 21.14,37.6 32.12,26.63 32.12,22.97 33.72,21.37 45.95,21.37 46.98,20.34 IC7.16 | v57.84,45.61 65.15,45.61 65.84,44.92 65.84,44.35 66.86,43.32 67.44,43.32 68.47,42.29 68.47,41.72 74.52,35.66 77.38,35.66 IC3.13
  Bottom 0.305: IC4.13 83.31,35.56 82.34,34.59 80.22,34.59 79.25,35.56 IC3.13 | v53.38,28.46 53.38,23.32 51.89,21.83 49.84,21.83 48.35,20.34 47.09,20.34 IC7.16 | v50.63,33.6 49.84,34.4 49.84,44.58 53.55,48.29 | 53.55,48.29 53.61,48.35 53.61,52.01 v59.66,58.06 | v19.32,65.61 19.32,61.15 21.6,58.86 21.6,45.38 21.14,44.92 21.14,39.09 v21.37,38.86 | v57.84,45.61 56.24,45.61 53.55,48.29
  Bottom 0.61: JP8.9 IC6.20
D3  (via drill 0.35)
  Top 0.305: v57.04,23.89 v53.72,20.57 | v63.78,23.89 63.78,24.92 63.89,25.03 63.89,36.46 62.29,38.06 IC3.15 | v77.84,57.38 70.07,57.38 62.75,64.69 62.29,64.69 IC8.31 | v16.69,68.35 v16.69,73.84 | v11.43,63.09 11.43,49.15 12.57,48.01 12.57,21.49 v12.34,21.26
  Bottom 0.305: IC3.15 75.44,38.1 76.41,39.06 78.94,39.06 79.9,38.1 IC4.15 81.04,38.18 81.04,50.63 77.84,53.84 v77.84,57.38 | v53.72,20.57 52.46,19.32 49.84,19.32 48.35,17.83 47.09,17.83 IC7.15 46.86,17.83 45.95,18.75 18.52,18.75 16,21.26 v12.34,21.26 | v63.78,23.89 v57.04,23.89 | v16.69,73.84 IC6.19 | v11.43,63.09 v16.69,68.35
  Bottom 0.61: JP8.8 IC6.19
D4  (via drill 0.35)
  Top 0.305: v56.46,15.32 55.32,14.17 49.84,14.17 48.81,15.2 47.09,15.2 IC7.14 | v66.64,16.12 66.64,16.46 66.41,16.69 66.41,18.75 65.49,19.66 65.49,36.92 63.32,39.09 61.15,39.09 60.58,38.52 60.58,37.26 62.18,35.66 IC3.16 | v72.35,54.18 76.47,50.06 76.47,45.49 79.55,42.41 79.55,37.38 81.27,35.66 IC4.16 | v11.89,73.15 10.06,73.15 8.46,74.75 2.63,74.75 1.94,74.07 1.94,36.35 11.66,26.63 11.66,20.92 v12.34,20.23
  Bottom 0.305: IC4.16 79.9,35.56 78.94,36.52 76.41,36.52 75.44,35.56 IC3.16 | v56.46,15.32 57.38,16.23 66.52,16.23 v66.64,16.12 | v72.35,54.18 64.81,61.72 64.81,64.69 IC8.30 | v11.89,73.15 18.06,73.15 22.29,77.38 22.63,77.38 IC6.18 | v12.34,20.23 14.52,20.23 18.52,16.23 46.06,16.23 46.98,15.32 IC7.14
  Bottom 0.61: JP8.7 IC6.18
D5  (via drill 0.35)
  Top 0.305: v53.72,17.14 55.66,17.14 v56.46,17.95 | v67.55,32.92 v67.55,18.63 | v77.15,58.06 74.52,58.06 67.89,64.69 67.32,64.69 IC8.29 | v76.24,44.69 76.24,41.38 79.1,38.52 79.1,36.69 79.55,36.23 79.55,34.75 IC4.17 | v20,68.12 v25.26,73.38 | v20.46,39.09 20.46,38.75 20.69,38.52 20.69,21.49 v27.66,14.52
  Bottom 0.305: IC4.17 79.9,33.02 78.94,33.98 76.41,33.98 75.44,33.02 67.55,33.02 | 67.55,33.02 IC3.17 | v53.72,17.14 53.72,16.12 51.78,14.17 49.84,14.17 48.46,12.8 47.09,12.8 IC7.13 46.86,12.69 45.83,13.72 33.03,13.72 32.23,14.52 v27.66,14.52 | v56.46,17.95 57.26,18.75 67.44,18.75 v67.55,18.63 | v67.55,32.92 67.55,33.02 | v77.15,58.06 77.15,51.32 76.24,50.41 v76.24,44.69 | v25.26,73.38 25.26,77.27 IC6.17 | v20,68.12 18.06,68.12 13.72,63.78 13.72,60.69 17.26,57.15 18.06,57.15 18.17,57.26 20.23,57.26 21.03,56.46 21.03,45.49 20.69,45.15 20.69,39.32 v20.46,39.09
  Bottom 0.61: JP8.6 IC6.17
D6  (via drill 0.35)
  Top 0.305: v56.58,10.74 54.98,9.14 49.72,9.14 48.81,10.06 47.09,10.06 IC7.12 | 65.95,15.43 65.95,18.52 64.81,19.66 v64.81,30.4 | 65.95,15.43 v65.95,10.97 | v69.84,54.18 73.95,50.06 v73.95,46.52 | v66.64,38.86 66.64,19.2 66.86,18.97 66.86,16.92 67.32,16.46 67.32,15.77 66.98,15.43 65.95,15.43 | v18.4,67.44 18.4,69.38 19.89,70.87 20.92,70.87 27.43,77.38 27.89,77.38 IC6.16 | v17.6,57.84 17.6,56.46 17.37,56.24 17.37,50.41 18.52,49.26 26.86,49.26 29.38,46.75 35.32,46.75 36.01,46.06 36.01,45.38 34.86,44.23 33.26,44.23 32.58,43.55 32.58,42.86 33.83,41.6 35.43,41.6 v41.95,35.09 | v54.29,32.69 56.69,30.29 56.69,30.18 57.38,29.49 61.27,29.49 62.18,30.4 IC3.18
  Bottom 0.305: IC4.18 79.9,30.48 78.94,31.45 76.41,31.45 75.44,30.48 64.81,30.48 | 64.81,30.48 IC3.18 | v56.58,10.74 56.92,10.74 57.38,11.2 65.72,11.2 v65.95,10.97 | v64.81,30.4 64.81,30.48 | v69.84,54.18 63.78,60.24 63.78,65.84 64.35,66.41 67.78,66.41 69.38,64.81 69.84,64.81 IC8.28 | v73.95,46.52 73.95,45.03 73.5,44.58 73.5,44.01 72.47,42.98 71.89,42.98 70.98,42.06 70.98,41.49 68.35,38.86 v66.64,38.86 | v18.4,67.44 14.17,63.21 14.17,61.27 v17.6,57.84 | v41.95,35.09 41.95,34.75 44.01,32.69 v54.29,32.69
  Bottom 0.61: JP8.5 IC6.16
D7  (via drill 0.35)
  Top 0.305: v60.35,8.8 60.24,8.69 49.84,8.69 48.81,7.66 47.09,7.66 IC7.11 | v65.95,8.46 65.95,9.94 68.24,12.23 v68.24,27.89 | v70.07,51.44 v67.32,54.18 | v70.64,47.78 73.84,44.58 73.84,39.66 76.92,36.58 78.52,36.58 79.1,36.01 79.1,34.18 79.55,33.72 79.55,29.72 81.27,28 IC4.19 | v19.55,66.52 30.4,77.38 IC6.15 | v16.34,60.12 16.69,60.12 16.92,59.89 16.92,45.95 13.03,42.06 v13.03,14.06
  Bottom 0.305: IC4.19 79.9,27.94 78.94,28.91 76.41,28.91 75.44,27.94 68.24,27.94 | 68.24,27.94 IC3.19 | v60.35,8.8 60.81,8.8 60.92,8.69 65.72,8.69 v65.95,8.46 | v68.24,27.89 68.24,27.94 | v67.32,54.18 63.32,58.18 63.32,66.06 64.12,66.86 69.84,66.86 71.89,64.81 72.35,64.81 IC8.27 | v70.07,51.44 70.87,50.63 70.87,48.01 v70.64,47.78 | v19.55,66.52 19.2,66.52 16.34,63.66 v16.34,60.12 | v13.03,14.06 18.4,8.69 31.09,8.69 33.15,6.63 36.35,6.63 38.41,8.69 45.95,8.69 46.98,7.66 IC7.11
  Bottom 0.61: JP8.4 IC6.15
DX0
  Bottom 0.305: IC2.2 49.02,27.94 48.05,26.98 45.93,26.98 44.97,27.94 IC7.2 36.31,27.94 35.35,26.98 33.23,26.98 32.27,27.94 IC1.12
DX1
  Bottom 0.305: IC2.3 49.02,25.4 48.05,24.43 45.93,24.43 44.97,25.4 IC7.3 36.31,25.4 35.35,24.43 33.23,24.43 32.27,25.4 IC1.13
DX2
  Bottom 0.305: IC2.4 49.02,22.86 48.05,21.89 45.93,21.89 44.97,22.86 IC7.4 36.31,22.86 35.35,21.89 33.23,21.89 32.27,22.86 IC1.14
DX3
  Bottom 0.305: IC2.5 49.02,20.32 48.05,19.36 45.93,19.36 44.97,20.32 IC7.5 36.31,20.32 35.35,19.36 33.23,19.36 32.27,20.32 IC1.15
DX4
  Bottom 0.305: IC2.6 49.02,17.78 48.05,16.82 45.93,16.82 44.97,17.78 IC7.6 36.31,17.78 35.35,16.82 33.23,16.82 32.27,17.78 IC1.16
DX5
  Bottom 0.305: IC2.7 49.02,15.24 48.05,14.28 45.93,14.28 44.97,15.24 IC7.7 36.31,15.24 35.35,14.28 33.23,14.28 32.27,15.24 IC1.17
DX6
  Bottom 0.305: IC2.8 49.02,12.7 48.05,11.73 45.93,11.73 44.97,12.7 IC7.8 36.31,12.7 35.35,11.73 33.23,11.73 32.27,12.7 IC1.18
DX7
  Bottom 0.305: IC2.9 49.02,10.16 48.05,9.2 45.93,9.2 44.97,10.16 IC7.9 36.31,10.16 35.35,9.2 33.23,9.2 32.27,10.16 IC1.19
GND  (via drill 0.35)
  Top 0.61: v21.83,37.95 23.09,36.69 38.41,36.69 C4.1
  Bottom 0.305: IC4.14 83.31,38.1 82.34,37.13 80.22,37.13 79.25,38.1 IC3.14
  Bottom 0.406: C2.2 C1.2
  Bottom 0.61: C1.2 6.35,60.96 IC6.1 3.81,66.04 JP1.3 2.54,71.12 1.32,72.34 1.32,78.79 2.54,80.01 5.08,80.01 IC6.24 IC6.23 10.16,73.66 12.7,71.12 19.05,71.12 C8.2 24.13,68.58 24.13,67.01 24.28,63.35 24.28,61.11 25.4,59.99 C12.1 30.48,53.34 IC1.39 | C2.2 3.81,49.53 R3.2 2.54,40.64 2.54,33.02 2.59,33.02 S1.4 5.08,32.97 | 5.08,32.97 7.75,32.97 7.97,32.75 9.81,32.75 10.03,32.97 S1.3 15.19,33.02 IC1.10 IC1.9 IC1.8 | IC1.8 17.78,39.37 JP7.1 15.24,39.42 13.26,41.41 13.26,42.41 15.24,44.4 15.24,44.45 17.78,44.45 IC1.5 IC1.6 | IC2.10 50.8,6.35 C9.1 55.83,1.32 | TP1.TP-1 96.52,42.55 IC4.14 98.68,35.94 98.68,3.43 97.79,2.54 | 55.83,1.32 63.55,1.32 64.77,2.54 C6.2 C7.1 | JP6.10 63.5,78.74 | 63.5,78.74 63.5,76.2 C11.2 57.15,69.85 IC9.8 | 74.93,81.28 74.93,73.66 74.88,73.61 74.88,71.89 73.66,70.67 JP2.2 73.66,55.88 C10.1 73.66,53.34 55.88,53.34 54.61,52.07 IC8.7 54.61,48.26 55.88,46.99 59.69,46.99 62.23,44.45 | 74.93,81.28 80.01,81.28 JP3.2 | 55.83,1.32 41.86,1.32 40.64,2.54 C5.2 39.37,6.35 IC7.10 36.83,5.08 21.59,5.08 IC1.20 16.51,5.08 C3.- 15.24,7.62 5.08,17.78 5.08,32.97 | IC5.7 53.34,30.48 IC2.1 49.64,30.48 48.52,31.6 45.87,31.6 45.72,31.75 41.91,31.75 38.51,35.15 C4.1 | IC3.14 76.31,38.1 75.19,36.98 59.84,36.98 IC5.7 | IC5.7 59.69,36.83 59.69,41.91 62.23,44.45 | 62.23,44.45 JP4.2 | 63.5,78.74 64.06,79.3 69.08,79.3 71.07,81.28 74.93,81.28 | v21.83,37.95 19.32,37.95 IC1.8
  pour Bottom: 0,59.69 21.59,59.69 21.59,52.07 16.51,52.07 16.51,50.8 15.24,49.53 0,49.53
  pour Top: 1.27,59.69 16.51,59.69 16.51,50.8 15.24,49.53 1.27,49.53
IO1
  Bottom 0.61: JP6.2 IC9.14
IO2
  Bottom 0.61: JP6.3 IC9.13
IO3
  Bottom 0.61: JP6.4 IC9.12
IO4
  Bottom 0.61: JP6.5 IC9.11
IO5
  Bottom 0.61: JP6.6 IC9.10
IO6
  Bottom 0.61: JP6.7 IC9.9
IO7
  Bottom 0.305: IC9.7 53.38,69.95 53.38,72.92 58.41,77.95 58.41,81.27 JP6.8
IO/M  (via drill 0.35)
  Top 0.305: v23.09,64.58 32.92,74.41 32.92,77.38 IC6.14 | v21.83,44.58 29.38,44.58 33.26,40.69 34.29,40.69 IC1.34
  Bottom 0.305: IC1.34 34.29,40.58 38.18,40.58 42.98,35.78 IC5.1 | IC9.6 50.75,69.84 50.75,68.12 48.01,65.38 48.01,58.64 53.03,53.61 53.03,48.46 49.38,44.81 47.78,44.81 46.75,43.78 46.75,36.69 45.83,35.78 IC5.2 | v23.09,64.58 21.83,63.32 21.83,60.01 22.06,59.78 22.06,44.81 v21.83,44.58
  Bottom 0.61: IC5.1 IC5.2
M/IO
  Top 0.305: IC5.9 55.78,43.2 55.44,43.2 53.84,44.81 49.95,44.81 48.35,43.2 IC5.12
  Bottom 0.61: IC5.3 IC5.12
N$1
  Bottom 0.406: IC1.1 15.11,55.88 Q1.2 13.84,57.02 12.7,55.88 C1.1
N$2
  Bottom 0.406: C2.1 9.02,52.2 Q1.1 17.91,52.2 IC1.2
N$3
  Bottom 0.305: D2.+ 12.7,48.26 IC1.4
N$4
  Bottom 0.305: R3.1 D2.-
N$5
  Top 0.305: IC6.6 8.89,73.66 JP1.2
N$6
  Top 0.305: R2.2 17.42,17.42 17.42,43.58 17.78,43.94 17.78,44.45 18.09,44.76 20.11,44.76 21.07,45.72 IC1.36
  Bottom 0.61: R2.2 8.89,6.35 C3.+ 8.89,5.08 R1.2 D1.A
N$7
  Top 0.305: S1.2 8.89,21.74 R2.1
  Bottom 0.61: S1.1 15.14,25.3 R2.1
N$8
  Bottom 0.305: IC5.10 53.34,40.64 55.88,38.1 IC5.6
N$9  (via drill 0.35)
  Top 0.305: v42.86,45.49 39.43,48.92 39.43,49.49 IC8.1 | v50.86,53.95 51.21,53.95 54.63,57.38 60.01,57.38 61.27,58.64 61.27,66.64 v62.64,68.01 | v71.32,76.69 73.5,78.87 74.98,78.87 76.12,80.01 JP2.9
  Bottom 0.305: v42.86,45.49 47.55,45.49 50.86,48.81 v50.86,53.95 | v71.32,76.69 v62.64,68.01
N$10
  Bottom 0.61: IC6.2 10.16,69.85 JP1.1
N$11  (via drill 0.35)
  Top 0.305: v48.23,55.89 50.18,55.89 53.61,59.32 53.61,65.84 54.63,66.86 56.01,66.86 62.06,72.92 72.58,72.92 73.5,73.84 74.18,73.84 75.09,74.75 75.09,76.35 76.12,77.38 JP2.7
  Bottom 0.305: v48.23,55.89 41.95,49.61 IC8.2
N$12  (via drill 0.35)
  Top 0.305: v55.89,48.69 54.63,47.43 46.29,47.43 44.46,49.26 44.46,49.49 IC8.3
  Bottom 0.305: v55.89,48.69 55.89,50.41 58.18,52.69 74.41,52.69 76.47,54.75 76.47,68.58 77.27,69.38 77.27,73.84 76.24,74.87 JP2.5
N$13
  Top 0.305: IC8.4 47.09,49.61 47.09,51.32 58.64,62.87 58.64,65.84 61.49,68.69 74.07,68.69 75.09,69.72 75.09,71.32 76.12,72.35 JP2.3
N$14  (via drill 0.35)
  Top 0.305: v54.06,71.55 45.38,71.55 44.69,70.87 44.69,69.27 43.55,68.12 42.52,68.12 39.43,65.04 39.43,64.81 IC8.40
  Bottom 0.305: v54.06,71.55 54.06,71.21 54.86,70.41 54.86,68.81 55.55,68.12 59.32,68.12 71.21,80.01 JP2.10
N$15
  Bottom 0.305: IC8.39 41.83,64.81 41.83,66.52 39.66,68.69 39.66,78.52 40.23,79.1 41.15,79.1 42.18,78.07 42.18,76.35 46.98,71.55 51.21,71.55 52.35,70.41 52.35,68.81 53.49,67.67 59.55,67.67 69.27,77.38 73.61,77.38 JP2.8
N$16
  Top 0.305: IC8.38 44.46,64.81 44.46,65.04 47.55,68.12 53.72,68.12 54.86,69.27 54.86,71.21 57.04,73.38 72.12,73.38 73.61,74.87 JP2.6
N$17  (via drill 0.35)
  Top 0.305: v53.38,66.64 49.26,66.64 47.43,64.81 47.09,64.81 IC8.37
  Bottom 0.305: v53.38,66.64 63.21,66.64 68.92,72.35 73.61,72.35 JP2.4
N$18
  Top 0.305: IC8.21 87.67,64.81 87.67,73.61 91.44,77.38 JP3.9
N$19
  Bottom 0.305: JP3.7 88.9,50.8 IC8.20
N$20
  Bottom 0.305: JP3.5 86.36,50.8 IC8.19
N$21
  Bottom 0.305: IC8.18 83.82,50.8 JP3.3
N$22
  Top 0.305: JP3.10 90.3,78.87 90.3,77.27 85.15,72.12 85.15,64.81 IC8.22
N$23
  Top 0.305: IC8.23 82.64,64.81 82.64,72.24 87.78,77.38 87.78,78.98 88.81,80.01 JP3.8
N$24
  Top 0.305: IC8.24 80.01,71.44 85.27,76.69 85.27,78.98 86.3,80.01 JP3.6
N$25
  Bottom 0.305: IC8.25 77.5,64.81 77.5,68.92 82.75,74.18 82.75,78.98 83.78,80.01 JP3.4
N$26
  Bottom 0.305: IC8.17 80.01,46.75 75.21,41.95 74.98,41.95 JP4.9
N$27
  Top 0.305: IC8.13 69.95,49.49 74.98,44.46 JP4.10
N$28
  Bottom 0.305: IC8.16 77.38,49.49 77.38,44.81 75.55,42.98 73.5,42.98 72.47,41.95 JP4.7
N$29
  Bottom 0.305: IC8.15 74.87,49.49 74.87,48.46 70.98,44.58 70.98,42.98 69.95,41.95 JP4.5
N$30
  Bottom 0.305: IC8.14 72.35,49.49 72.35,48.46 68.47,44.58 68.47,43.09 67.32,41.95 JP4.3
N$31
  Top 0.305: IC8.12 67.32,49.49 72.35,44.46 JP4.8
N$32
  Top 0.305: JP4.6 IC8.11
N$33
  Top 0.305: IC8.10 62.29,49.49 67.32,44.46 JP4.4
N$36
  Bottom 0.305: IC9.15 40.69,77.38 40.69,74.41 44.69,70.41 44.69,66.64 45.95,65.38 45.95,60.01 52.01,53.95 52.01,49.61 IC8.6
RESET
  Top 0.305: IC1.3 19.09,50.75 26.06,50.75 29.6,47.21 35.32,47.21 36.01,47.89 36.01,51.21 34.86,52.35 33.15,52.35 31.77,53.72 31.77,56.81 32.46,57.49 41.38,57.49 41.72,57.15 50.75,57.15 52.01,58.41 52.01,64.69 IC8.35
RST7.5  (via drill 0.35)
  Top 0.305: v59.21,74.52 65.95,81.27 JP6.11 | v56.92,72.24 56.92,68.81 55.44,67.32 47.43,67.32 45.49,65.38 45.49,63.78 43.43,61.72 v43.09,61.72 | v32.8,44.81 29.83,44.81 29.38,45.26 21.49,45.26 20.69,44.46 20.69,42.29 19.09,40.69 IC1.7
  Bottom 0.305: v56.92,72.24 v59.21,74.52 | v43.09,61.72 43.09,57.49 34.86,49.26 33.26,49.26 32.58,48.58 32.58,45.03 v32.8,44.81
  Bottom 0.61: IC1.7 16.51,40.64 JP7.2
VCC  (via drill 0.35)
  Top 0.61: R1.1 6.35,6.35 10.16,2.54 43.18,2.54 C5.1 46.99,3.81 55.88,3.81 C9.2 | C7.2 82.55,3.81 IC4.28 81.28,5.38 79.5,7.16 79.5,8.08 80.16,8.74 82.1,8.74 83.06,9.7 83.06,37.34 87.72,42.01 | JP6.9 60.96,78.74 C11.1 57.15,74.93 39.37,74.93 38.1,76.2 IC9.16 35.56,74.93 IC6.12 | JP3.1 80.01,76.2 80.01,72.39 77.47,69.85 JP2.1 74.93,68.58 IC8.26 C10.2 | IC1.35 36.83,43.18 | 36.83,43.18 37.08,43.18 C4.2 41.76,41.76 IC5.14 43.18,37.8 44.3,36.68 44.3,34.44 46.99,31.75 IC7.20 | IC1.40 36.83,53.34 36.83,43.18 | TP1.TP-2 94.61,46.99 92.71,46.99 87.72,42.01 | JP4.1 64.69,41.83 62.98,41.83 59.78,38.63 59.78,31.77 58.52,30.52 IC2.20 | 87.72,42.01 81.15,48.58 81.15,50.63 76.24,55.55 v75.78,55.55
  Bottom 0.305: IC4.28 79.9,5.08 78.94,6.04 76.41,6.04 75.44,5.08 IC3.28 C9.2 | C7.2 JP5.1
  Bottom 0.61: IC1.40 31.75,58.42 | 31.75,58.42 C12.2 | 31.75,58.42 IC6.12 35.56,64.77 34.29,66.04 29.21,66.04 C8.1 | D1.C R1.1 | C6.1 IC3.28 | IC2.20 55.69,30.48 54.57,29.36 | IC7.20 48.56,30.48 49.68,29.36 54.57,29.36 | C9.2 54.57,7.66 54.57,29.36 | v75.78,55.55 75.78,58.86 74.98,59.66 C10.2

### Text on the board
tNames: Issue 2 | OMEN ALPHA
tValues: +5 / GND